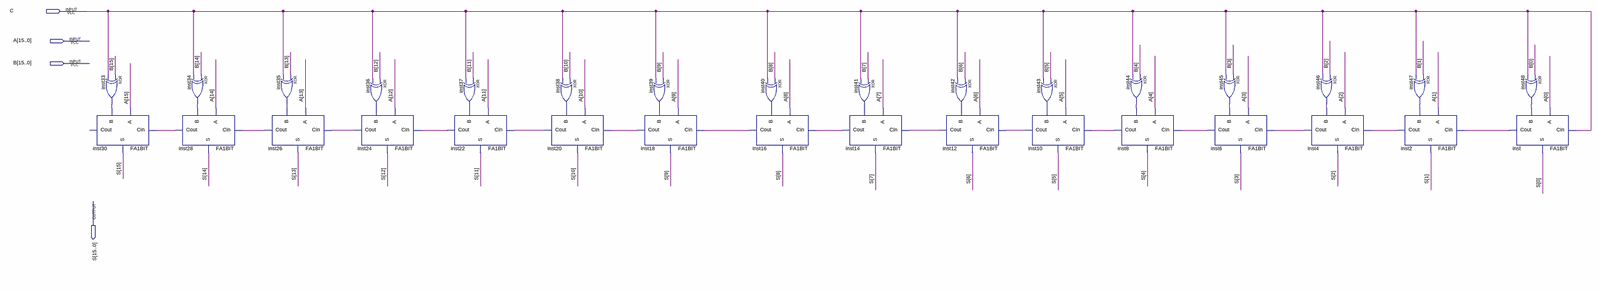
[diagram p0: schematic sheet, whole]
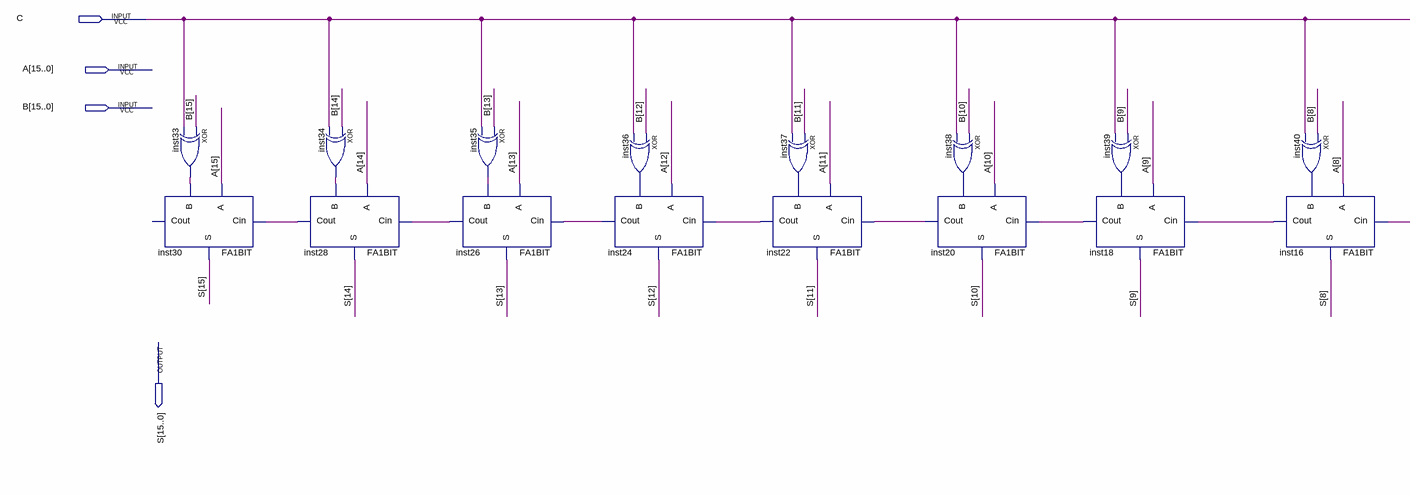
[diagram p1: schematic sheet, left part]
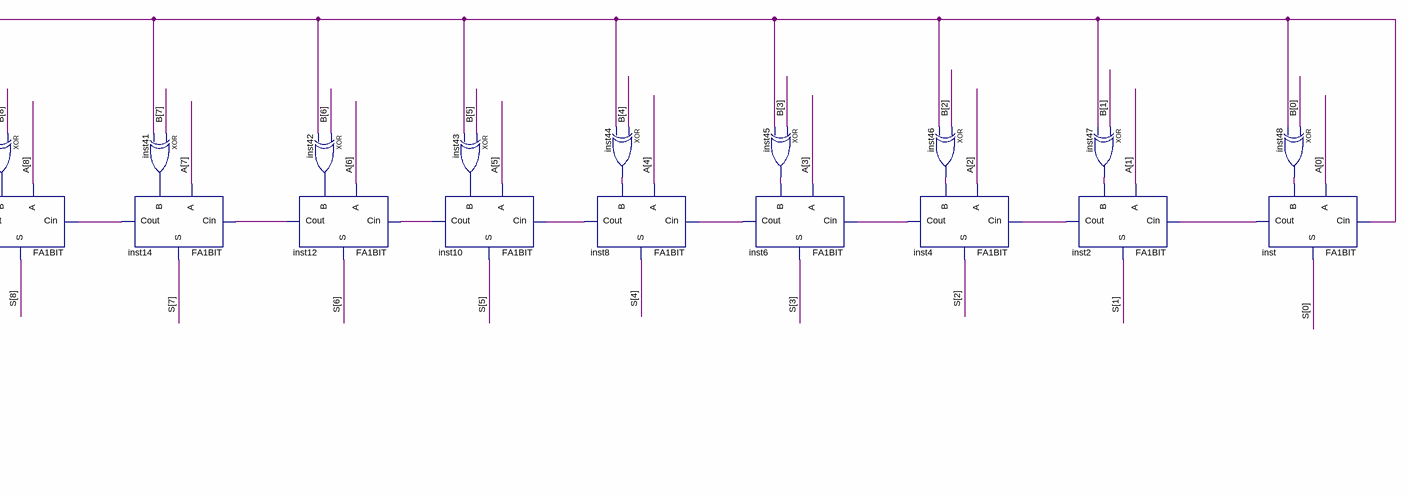
[diagram p2: schematic sheet, right part]
// Quartus schematic ADDSUB16BIT.bdf as structural Verilog: 32 symbols, 4 pins
module ADDSUB16BIT (
  input  C,
  input  [15:0] A,
  input  [15:0] B,
  output [15:0] S
);

  wire inst2_cout, inst4_cout, inst6_cout, inst8_cout, inst10_cout, inst12_cout, inst14_cout, inst16_cout,
       inst18_cout, inst20_cout, inst22_cout, inst24_cout, inst26_cout, inst28_cout, inst33_out, inst34_out,
       inst35_out, inst36_out, inst37_out, inst38_out, inst39_out, inst40_out, inst41_out, inst42_out,
       inst43_out, inst44_out, inst45_out, inst46_out, inst47_out, inst48_out, inst_cout;

  xor inst33 (inst33_out, B[15], C);
  FA1BIT inst30 (.A(A[15]), .B(inst33_out), .Cin(inst28_cout), .S(S[15]));  // open: Cout
  xor inst34 (inst34_out, B[14], C);
  FA1BIT inst28 (.A(A[14]), .B(inst34_out), .Cin(inst26_cout), .Cout(inst28_cout), .S(S[14]));
  xor inst35 (inst35_out, B[13], C);
  FA1BIT inst26 (.A(A[13]), .B(inst35_out), .Cin(inst24_cout), .Cout(inst26_cout), .S(S[13]));
  xor inst36 (inst36_out, B[12], C);
  FA1BIT inst24 (.A(A[12]), .B(inst36_out), .Cin(inst22_cout), .Cout(inst24_cout), .S(S[12]));
  xor inst37 (inst37_out, B[11], C);
  FA1BIT inst22 (.A(A[11]), .B(inst37_out), .Cin(inst20_cout), .Cout(inst22_cout), .S(S[11]));
  FA1BIT inst20 (.A(A[10]), .B(inst38_out), .Cin(inst18_cout), .Cout(inst20_cout), .S(S[10]));
  xor inst38 (inst38_out, B[10], C);
  FA1BIT inst18 (.A(A[9]), .B(inst39_out), .Cin(inst16_cout), .Cout(inst18_cout), .S(S[9]));
  xor inst39 (inst39_out, B[9], C);
  xor inst40 (inst40_out, B[8], C);
  FA1BIT inst16 (.A(A[8]), .B(inst40_out), .Cin(inst14_cout), .Cout(inst16_cout), .S(S[8]));
  FA1BIT inst14 (.A(A[7]), .B(inst41_out), .Cin(inst12_cout), .Cout(inst14_cout), .S(S[7]));
  xor inst41 (inst41_out, B[7], C);
  FA1BIT inst12 (.A(A[6]), .B(inst42_out), .Cin(inst10_cout), .Cout(inst12_cout), .S(S[6]));
  xor inst42 (inst42_out, B[6], C);
  FA1BIT inst10 (.A(A[5]), .B(inst43_out), .Cin(inst8_cout), .Cout(inst10_cout), .S(S[5]));
  xor inst43 (inst43_out, B[5], C);
  FA1BIT inst8 (.A(A[4]), .B(inst44_out), .Cin(inst6_cout), .Cout(inst8_cout), .S(S[4]));
  xor inst44 (inst44_out, B[4], C);
  FA1BIT inst6 (.A(A[3]), .B(inst45_out), .Cin(inst4_cout), .Cout(inst6_cout), .S(S[3]));
  xor inst45 (inst45_out, B[3], C);
  xor inst46 (inst46_out, B[2], C);
  FA1BIT inst4 (.A(A[2]), .B(inst46_out), .Cin(inst2_cout), .Cout(inst4_cout), .S(S[2]));
  xor inst47 (inst47_out, B[1], C);
  FA1BIT inst2 (.A(A[1]), .B(inst47_out), .Cin(inst_cout), .Cout(inst2_cout), .S(S[1]));
  xor inst48 (inst48_out, B[0], C);
  FA1BIT inst (.A(A[0]), .B(inst48_out), .Cin(C), .Cout(inst_cout), .S(S[0]));
endmodule
